# Altium schematic sheet X-01 NOTE.SchDoc
size 513 x 386 mm
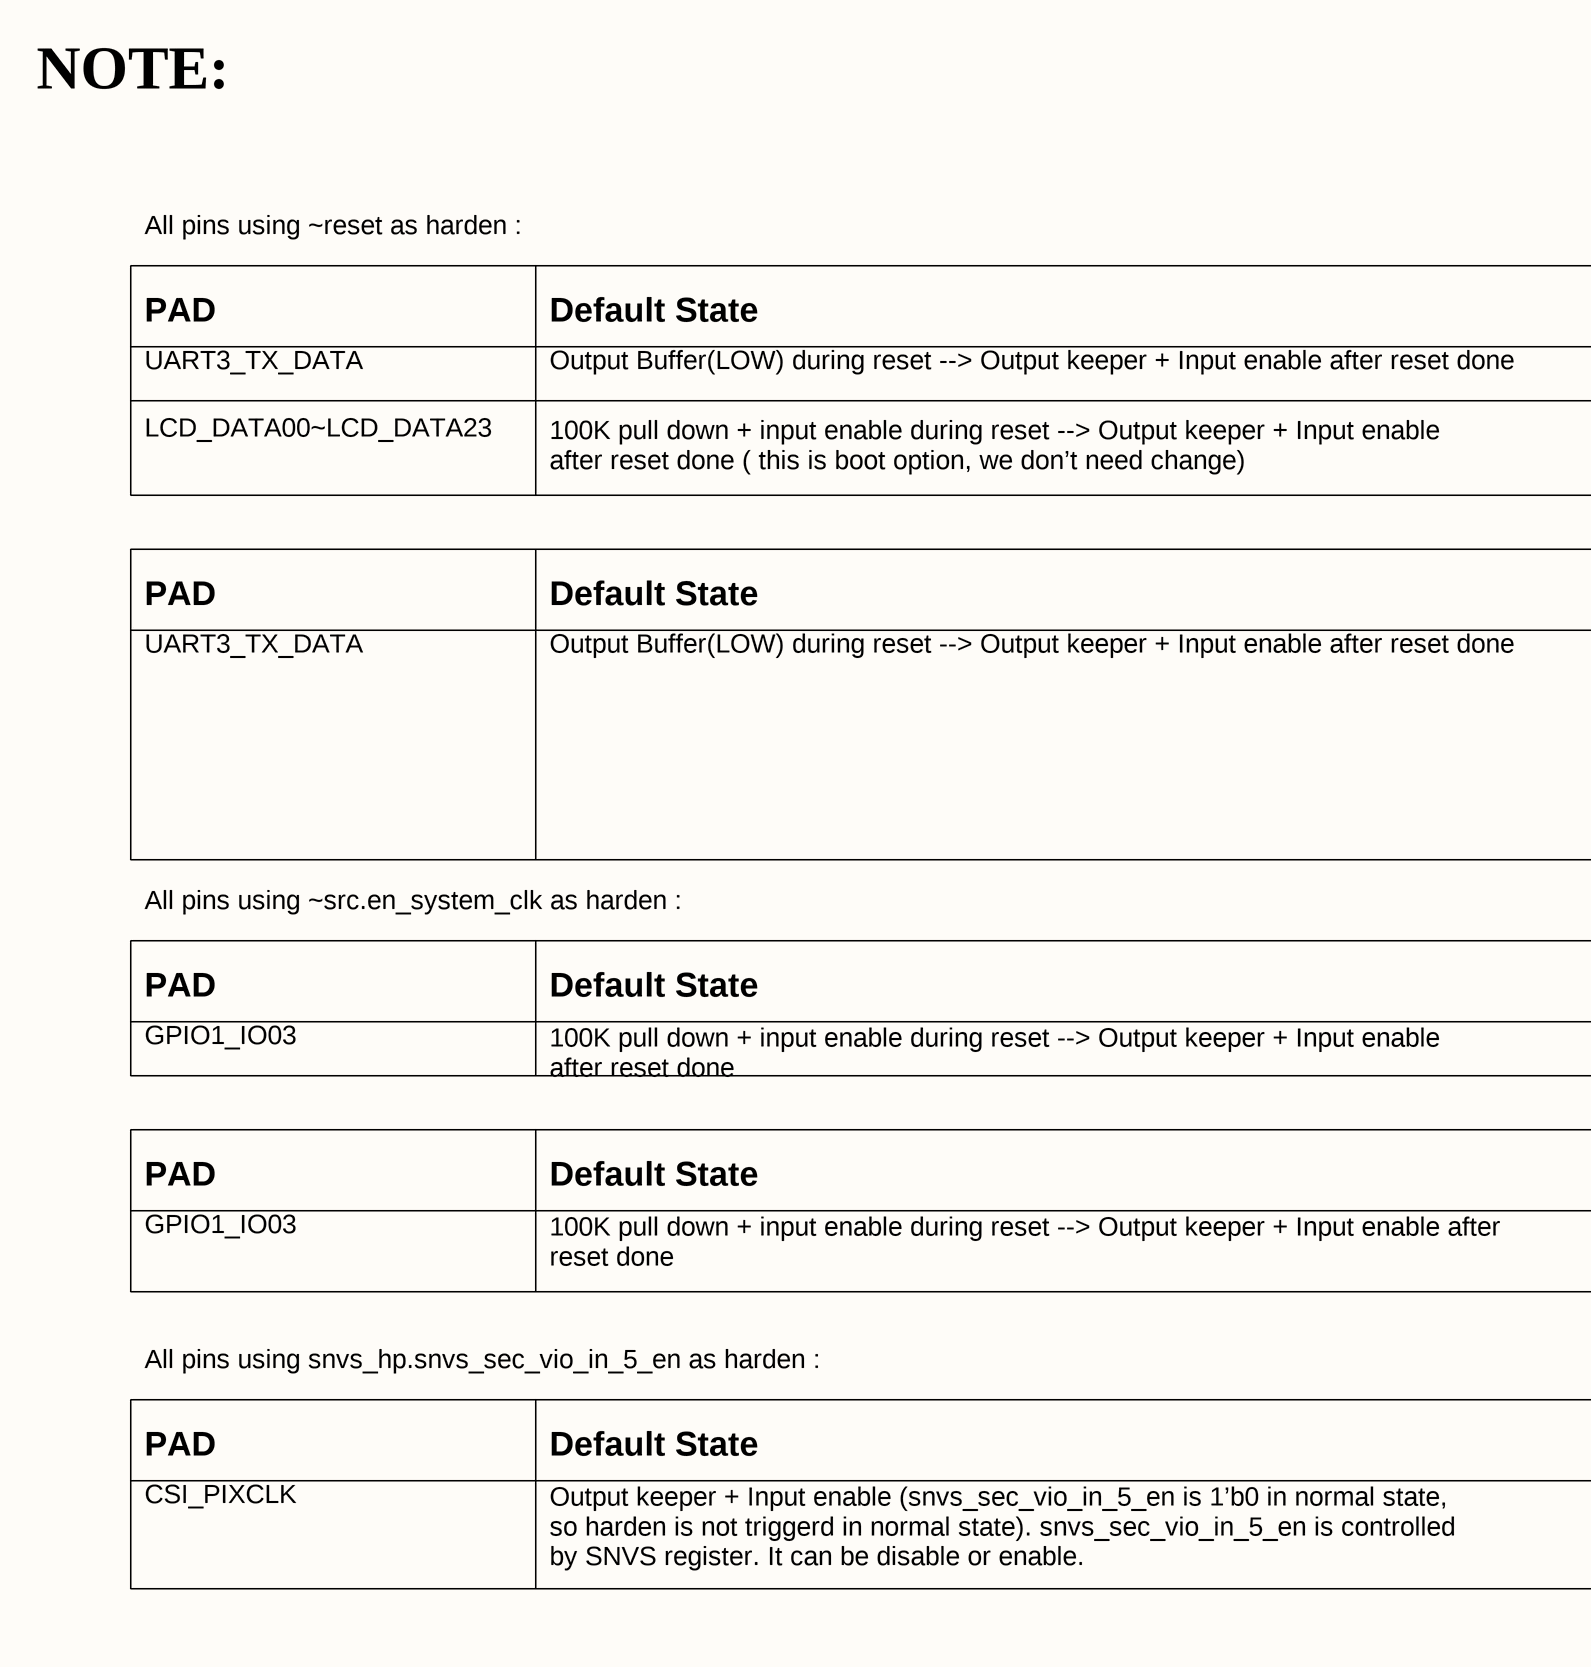
[diagram p0: X-01 NOTE.SchDoc, left]
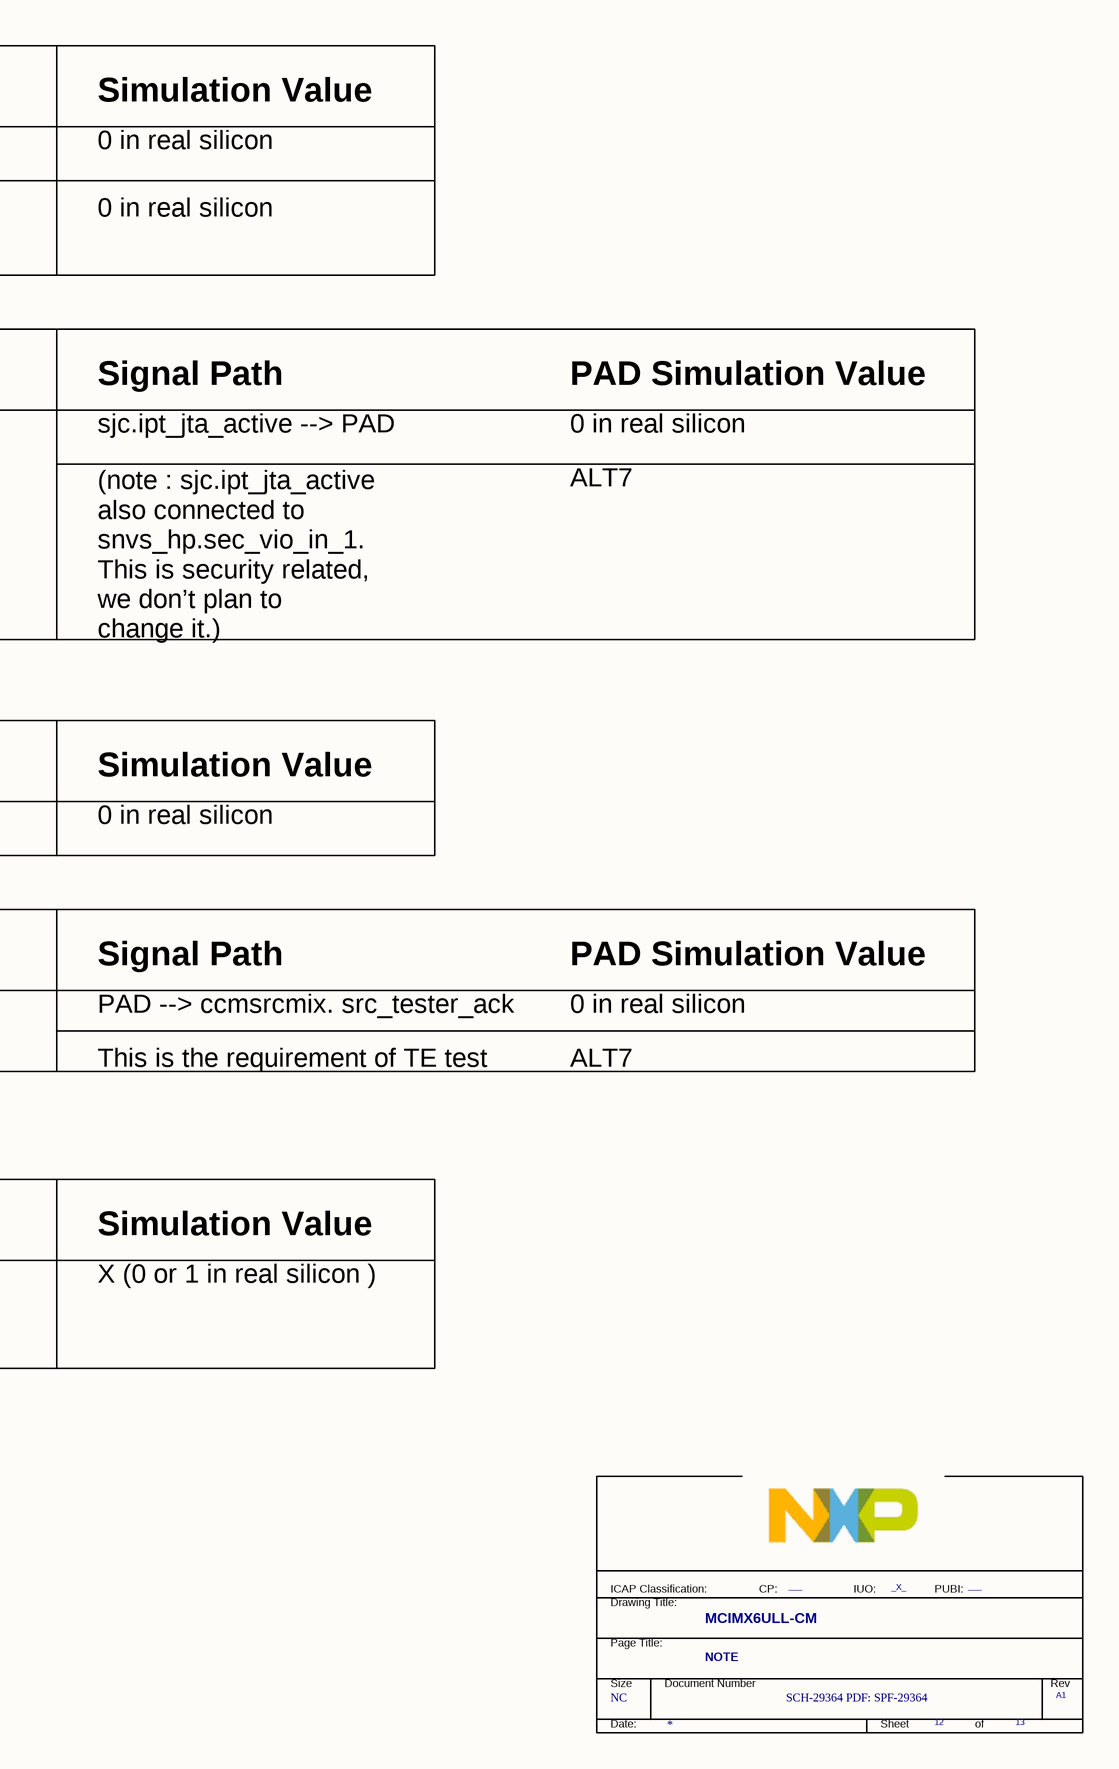
[diagram p1: X-01 NOTE.SchDoc, right]

## Parts
*  PageTitle: NOTE  Page Count: 13  Page Number: 12  Page Size: NC  Title: MCIMX6ULL-CM  RevCode: A1  Doc: SCH-29364 PDF: SPF-29364  FCP: ___  FIUO: _X_  (hidden comment: TitleBlock_FS)  (graphical)

## Notes on the sheet
- NOTE:
- All pins using ~reset as harden :
- PAD
- UART3_TX_DATA
- Output Buffer(LOW) during reset --> Output keeper + Input enable after reset done
- Default State
- 0 in real silicon
- Simulation Value
- LCD_DATA00~LCD_DATA23
- 100K pull down + input enable during reset --> Output keeper + Input enable
  after reset done ( this is boot option, we don’t need change)
- Signal Path
- PAD Simulation Value
- sjc.ipt_jta_active --> PAD
- ALT7
- All pins using ~src.en_system_clk as harden :
- (note : sjc.ipt_jta_active
  also connected to
  snvs_hp.sec_vio_in_1.
  This is security related,
  we don’t plan to
  change it.)
- GPIO1_IO03
- 100K pull down + input enable during reset --> Output keeper + Input enable
  after reset done
- PAD --> ccmsrcmix. src_tester_ack
- 100K pull down + input enable during reset --> Output keeper + Input enable after
  reset done
- This is the requirement of TE test
- All pins using snvs_hp.snvs_sec_vio_in_5_en as harden :
- CSI_PIXCLK
- X (0 or 1 in real silicon )
- Output keeper + Input enable (snvs_sec_vio_in_5_en is 1’b0 in normal state,
  so harden is not triggerd in normal state). snvs_sec_vio_in_5_en is controlled
  by SNVS register. It can be disable or enable.
- (in symbol TitleBlock_FS) ICAP Classification:; CP:; IUO:; PUBI:; Drawing Title:; Page Title:; Size; Document Number; Rev; Date:; Sheet; of

## Library data of the parts
* = TitleBlock_FS: OrgName: Freescale Semiconductor; OrgAddr1: 6501 William Cannon Drive West; OrgAddr2: Austin, TX 78735-8598; Page Create Date: March  8, 1995; PUBI: ___; Page Modify Date: *